# Altium schematic sheet Buzzer.SchDoc
size 431 x 279 mm; SheetNumber: 8; SheetTotal: 8
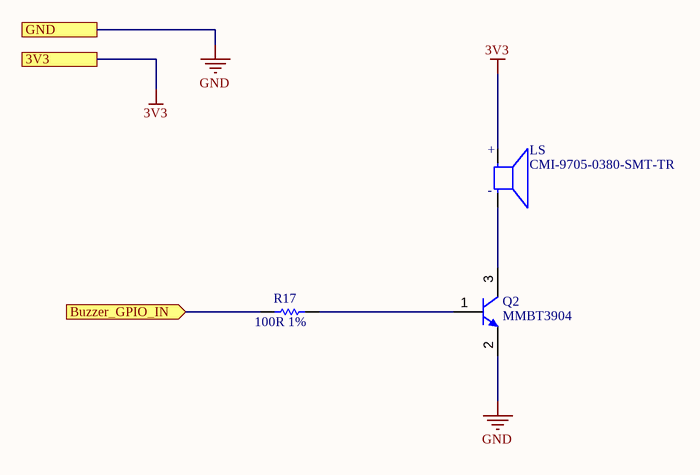
[diagram p0: Buzzer.SchDoc]

## Parts
LS  CMI-9705-0380-SMT-TR  [CUI_CMI-9705-0380-SMT-TR]
Q2  MMBT3904  [INF-SOT23_L]
R17  100R 1%  [RESC0603(1608)_N]

## Ports
3V3, Buzzer_GPIO_IN (in), GND

## Nets
3V3: LS.P ; port 3V3
GND: Q2.2(E) ; port GND
Buzzer_GPIO_IN: R17.1 ; port Buzzer_GPIO_IN
NetLS_N: LS.N Q2.3(C)
NetQ2_1: Q2.1(B) R17.2

## Notes on the sheet
- DWG. NO.
- REV.
- SHT.
- THIS DOCUMENT AND THE DATA DISCLOSED HEREIN OR HEREWITH IS THE PROPERTY OF ALTIUM LIMITED AND MAY BE FREELY DISTRIBUTED IN WHOLE. NO RIGHTS ARE RESERVED OR EXPRESS OR IMPLIED WARANTEE GIVEN.
- REVISION
- DESCRIPTION
- DATE
- APPROVED
- ENG:
- APPROVALS
- PROJECT
- DSN:
- CHK:
- REFERENCE DOCUMENTS
- PROJECT REVISION:
- TITLE
- DOCUMENT REVISION:
- DESIGN ITEM:
- BOM:
- FAB DWG:
- PCB DWG:
- ASSY DWG:
- SCALE:
- SIZE
- B
- CAGE CODE
- FILE NAME
- DWG NO.
- SHEET
- OF
- REV
- (in symbol CMI-9705-0380-SMT-TR) +; -

## Library data of the parts
LS = CMI-9705-0380-SMT-TR: 9.7 mm, 3 Vdc, 80 dB, Surface Mount, Driving Circuit, Magnetic Audio Indicator Buzzer; MF: CUI Devices; Value: *; CUI_purchase_URL: https://www.cuidevices.com/product/audio/buzzers/audio-indicators/cmi-9705-0380-smt-tr?utm_source=snapeda.com&utm_medium=referral&utm_campaign=snapedaBOM; Price: None; Package: CUI Inc.; SnapEDA_Link: https://www.snapeda.com/parts/CMI-9705-0380-SMT-TR/CUI%20Devices/view-part/3662541/?ref=snap; Availability: Unavailable; MP: CMI-9705-0380-SMT-TR
Q2 = CMP-1178-00008-1: NPN Silicon Switching Transistor, 40 V VCEO, 200 mA IC, SOT23, Reel, Green; Manufacturer: Infineon; IC (max): 200 mA; VCBO (max): 60 V; VCE (max): 1 V; Green: TRUE; ICBO (max): 50 nA; IC: 10 mA; VCEO (max): 40 V; VEBO (max): 6 V; ComponentLink3Description: Package Specification; ComponentLink2Description: Datasheet; PackageDescription: 3-Pin Small Outline Transistor Package, 1.3 x 2.9 mm Body, 0.95 mm Pitch; Packing: Reel; ComponentLink1Description: Manufacturer URL; Polarity: NPN; ComponentLink3URL: http://www.infineon.com/dgdl/SOT23-Package_Overview.pdf?folderId=db3a30431936bc4b0119532290053c66&fileId=db3a30431936bc4b0119533468123c85; PackageReference: SOT23; Mounting Technology: Surface Mount; VCE: 1 V; ComponentLink2URL: http://www.infineon.com/dgdl/smbt3904series_mmbt3904.pdf?folderId=db3a30431441fb5d011445fab851018e&fileId=db3a30431441fb5d0114460005c10191; PartNumber: MMBT3904; PackageVersion: Apr-08; ComponentLink1URL: http://www.infineon.com/
R17 = CMP-1012-00397-1: 100R 0.1W 1% 0603 (1608 Metric)  SMD; Value: 100.00 Ohm; Case-EIA: 0603; Case-Metric: 1608; Technology: SMT; Tolerance: 1 %; Power: 0.1 W